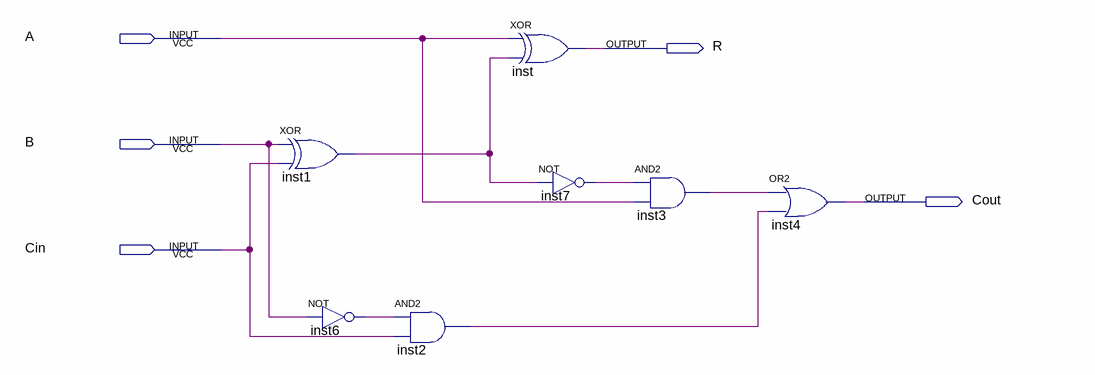
[diagram p0: schematic sheet]
// Quartus schematic fullSubtractor.bdf as structural Verilog: 7 symbols, 5 pins
module fullSubtractor (
  input  A,
  input  B,
  input  Cin,
  output R,
  output Cout
);

  wire inst1_out, inst2_out, inst3_out, inst6_out, inst7_out;

  xor inst1 (inst1_out, B, Cin);
  not inst6 (inst6_out, B);
  and inst2 (inst2_out, inst6_out, Cin);
  xor inst (R, A, inst1_out);
  not inst7 (inst7_out, inst1_out);
  and inst3 (inst3_out, inst7_out, A);
  or inst4 (Cout, inst3_out, inst2_out);
endmodule
